# Altium schematic sheet ADC.SchDoc
size A4; SheetNumber: 7; SheetTotal: 12
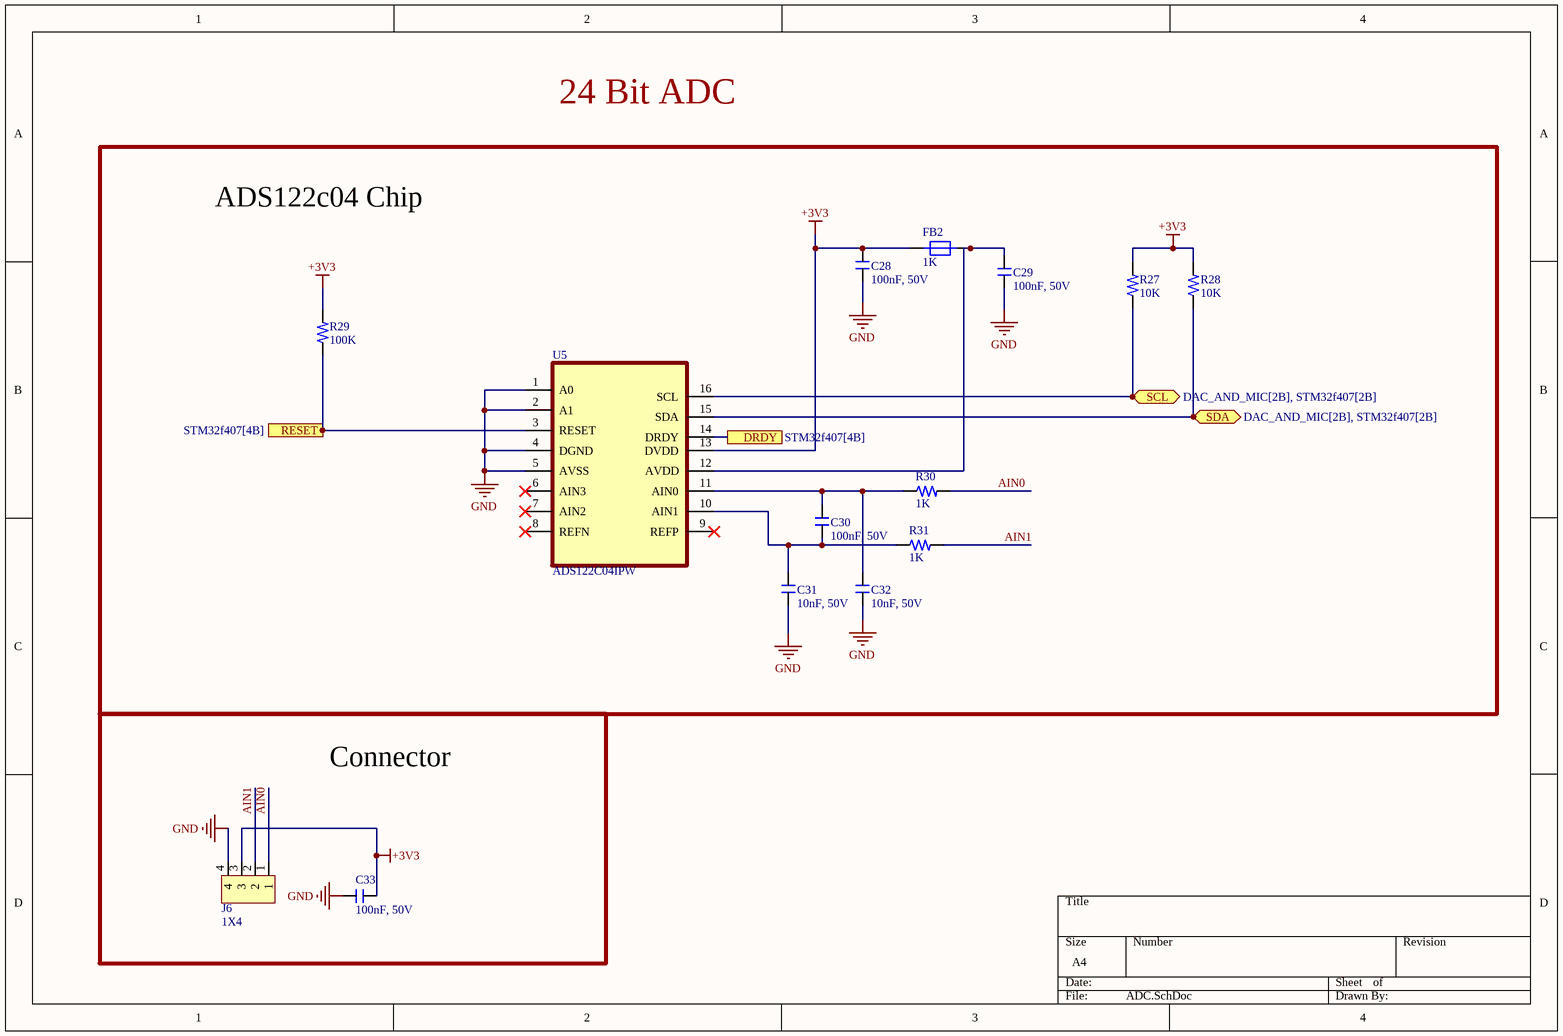
[diagram p0: ADC.SchDoc]

## Parts
C28  100nF, 50V  [Capacitor_0805]
C29  100nF, 50V  [Capacitor_0805]
C30  100nF, 50V  [Capacitor_0805]
C31  10nF, 50V  [Capacitor_0805]
C32  10nF, 50V  [Capacitor_0805]
C33  100nF, 50V  [Capacitor_0805]
FB2  1K  [FB_0805]
J6  1X4  [Header_1X4_2.54mm]
R27  10K  [Resistor_0603]
R28  10K  [Resistor_0603]
R29  100K  [Resistor_0603]
R30  1K  [Resistor_0603]
R31  1K  [Resistor_0603]
U5  ADS122C04IPW  [16_TSSOP]

## Blocks framed on the sheet
ADS122c04 Chip: C28-C32 FB2 R27-R31 U5
Connector: C33 J6

## Ports
DRDY (see STM32f407[4B]), RESET (see STM32f407[4B]), SCL (bidir, see DAC_AND_MIC[2B], STM32f407[2B]), SDA (bidir, see DAC_AND_MIC[2B], STM32f407[2B])

## Nets
+3V3: C28.2 C33.2 FB2.1 J6.3 R27.2 R28.2 R29.2 U5.13(DVDD)
GND: C28.1 C29.1 C31.1 C32.1 C33.1 J6.4 U5.1(A0) U5.2(A1) U5.4(DGND) U5.5(AVSS)
AIN0: J6.1 R30.2
AIN1: J6.2 R31.2
DRDY: U5.14(DRDY) ; port DRDY
RESET: R29.1 U5.3(RESET) ; port RESET
SCL: R27.1 U5.16(SCL) ; port SCL
SDA: R28.1 U5.15(SDA) ; port SDA
NetC29_2: C29.2 FB2.2 U5.12(AVDD)
NetC30_1: C30.1 C31.2 R31.1 U5.10(AIN1)
NetC30_2: C30.2 C32.2 R30.1 U5.11(AIN0)

Not connected (* = marked no-connect by the designer): U5 6(AIN3)* 7(AIN2)* 8(REFN)* 9(REFP)*

## Notes on the sheet
- 24 Bit ADC

## Library data of the parts
C28-C30 C33 = Cap_100nF_0805: Multilayer Ceramic Capacitor, 0.1 uF, 50 V, ï¿½ 10%, X7R, 0805 [2012 Metric]; Manufacturer: Samsung; Manufacturer Part Number: CL21B104KBCNNNC; Supplier: Digikey; Supplier Part Number: 1276-1003-1-ND; RoHS: Yes; Category: Ceramic Capacitors; Stock: 674609; Pricing: 1=0,08, 10=0,012, 100=0,0104, 1000=0,008 (USD); Mounting Technology: Surface Mount; Case/Package: 0805; Case Code (Metric): 2012; Case Code (Imperial): 0805; Material: Ceramic; Min Operating Temperature: -55°C; Max Operating Temperature: 125°C; Tolerance: 10%; Value: 100nF; Dielectric: X7R; Packaging: Tape and Reel; Voltage Rating: 50V; Voltage: 50V; Series: CL; Construction: Flat; Voltage Rating (DC): 50V; Length: 2mm; Width: 0.049inch; Height: 0.85mm; Depth: 1.25mm; Thickness: 0.037inch; Radiation Hardening: No; RoHS Compliant: Yes; Lead Free: 5697LeadFree; ComponentLink1URL: https://datasheet.ciiva.com/25710/cl21b104kbcnnnc-25710182.pdf?src-supplier=Digikey; ComponentLink1Description: https://datasheet.ciiva.com/25710/cl21b104kbcnnnc-25710182.pdf?src-supplier=Digikey; ComponentLink2URL: https://datasheet.ciiva.com/29199/454152-da-01-en-vs-kondensator-0805-29199814.pdf?src-supplier=Conrad; ComponentLink2Description: https://datasheet.ciiva.com/29199/454152-da-01-en-vs-kondensator-0805-29199814.pdf?src-supplier=Conrad
C31 C32 = Cap_10nF_0805: Multilayer Ceramic Capacitors MLCC - SMD/SMT 50V 0.01uF X7R 0805 10% AEC-Q200; Manufacturer: KEMET; Manufacturer Part Number: C0805C103K5RECAUTO; Dielectric: 1511DielectricType; Supplier: Arrow Electronics; Supplier Part Number: C0805C103K5RECAUTO; RoHS: Yes; Category: Ceramic Capacitors; Stock: 16; Pricing: 1=0,22, 10=0,0376 (USD); Voltage Rating (DC): 50V; ComponentLink1URL: http://www.farnell.com/datasheets/2723804.pdf?src-supplier=Farnell; ComponentLink1Description: http://www.farnell.com/datasheets/2723804.pdf?src-supplier=Farnell; ComponentLink2URL: https://api.kemet.com/component-edge/download/datasheet/C0805C103K5RECAUTO.pdf?src-supplier=Digikey; ComponentLink2Description: https://api.kemet.com/component-edge/download/datasheet/C0805C103K5RECAUTO.pdf?src-supplier=Digikey; ComponentLink3URL: http://www.farnell.com/datasheets/2723804.pdf?src-supplier=Newark; ComponentLink3Description: http://www.farnell.com/datasheets/2723804.pdf?src-supplier=Newark
FB2 = FB_BLM21SP102SH1D: Ferrite Beads Multi-Layer High Current 1KOhm 25% 100MHz 1.6A 0.12Ohm DCR 0805 Automotive T/R; Manufacturer: Murata; Core Material: 228ConductorMaterial; Value: 120mR; Supplier: Mouser; Supplier Part Number: 81-BLM21SP102SH1D; Manufacturer Part Number: BLM21SP102SH1D; RoHS: Yes; Category: Ferrite Beads and Chips; Stock: 4751; Pricing: 1=0,33, 10=0,179, 50=0,179, 100=0,159, 1000=0,105, 10000=0,083 (USD); RMS Current (Irms): 1.6A; ESR: 120mR; Test Frequency: 100MHz; Tolerance: 25%; Height: 1.05mm; ComponentLink1URL: https://datasheet.octopart.com/BLM21SP102SH1D-Murata-datasheet-138707452.pdf?src-supplier=Future+Electronics; ComponentLink1Description: https://datasheet.octopart.com/BLM21SP102SH1D-Murata-datasheet-138707452.pdf?src-supplier=Future+Electronics; ComponentLink2URL: https://www.murata.com/en-us/api/pdfdownloadapi?cate=luNoiseSupprFilteChipFerriBead&amp;partno=BLM21SP102SH1%23&src-supplier=Digikey; ComponentLink2Description: https://www.murata.com/en-us/api/pdfdownloadapi?cate=luNoiseSupprFilteChipFerriBead&amp;partno=BLM21SP102SH1%23&src-supplier=Digikey; ComponentLink3URL: https://datasheet.octopart.com/BLM21SP102SH1D-Murata-datasheet-166171483.pdf?src-supplier=TME; ComponentLink3Description: https://datasheet.octopart.com/BLM21SP102SH1D-Murata-datasheet-166171483.pdf?src-supplier=TME
J6 = Header_Male_1X4_2.54: THT Vertical Pin Header WR-PHD, Pitch 2.54 mm, Single Row, 4 pins; Manufacturer: Wurth Electronics; Manufacturer Part Number: 61300411121; Number of Positions: 4; Gender: 29Gender; Contact Resistance: 20mR; Current Rating: 3A; Operating Supply Voltage: 250V; Pitch: 0.1inch; Supplier: Digikey; Supplier Part Number: 732-5317-ND; RoHS: Yes; Category: Headers and Wire Housings; Stock: 28749; Pricing: 1=0,17, 10=0,147, 25=0,1216, 50=0,1018, 100=0,0918, 1000=0,085 (USD); Mounting Technology: Through Hole; Contact Plating: Gold; Contact Material: Copper; Color: Black; Min Operating Temperature: -40°C; Max Operating Temperature: 105°C; Number of Rows: 1; Packaging: Bulk; Termination: Solder; Number of Contacts: 4; Series: WR-PHD; Contact Type: Male Pin; Voltage Rating: 250V; Orientation: 5495OrientationType; Height: 8.89mm; Contact Mating Length: 0.236inch; RoHS Compliant: Yes; Reach SVHC Compliant: Unknown; Lead Free: 5697LeadFree; ComponentLink1URL: http://www.farnell.com/cad/1737268.pdf?src-supplier=Element14; ComponentLink1Description: http://www.farnell.com/cad/1737268.pdf?src-supplier=Element14; ComponentLink2URL: https://datasheet.octopart.com/61300411121-W%C3%BCrth-Elektronik-datasheet-21154836.pdf?src-supplier=Element14; ComponentLink2Description: https://datasheet.octopart.com/61300411121-W%C3%BCrth-Elektronik-datasheet-21154836.pdf?src-supplier=Element14; ComponentLink3URL: https://katalog.we-online.de/em/datasheet/6130xx11121.pdf?src-supplier=Digikey; ComponentLink3Description: https://katalog.we-online.de/em/datasheet/6130xx11121.pdf?src-supplier=Digikey
R27 R28 = R_10K_0603: SMD Chip Resistor, 10 kOhm, ï¿½ 1%, 100 mW, 0603 [1608 Metric], Thick Film, General Purpose; Manufacturer: Yageo; Manufacturer Part Number: RC0603FR-0710KL; Voltage Rating (DC): 50V; Value: 10kR; Temperature Coefficient: 100ppm/°C; Voltage Rating: 75V; Power Rating: 100mW; Supplier: Digikey; Supplier Part Number: 311-10.0KHRCT-ND; RoHS: Yes; Category: Chip SMD Resistors; Stock: 2808060; Pricing: 1=0,1, 10=0,009, 100=0,0071, 1000=0,00612 (USD); Case/Package: 0603; Pins: 2; Case Code (Imperial): 0603; Case Code (Metric): 1608; Weight: 7.1E-05oz; Min Operating Temperature: -55°C; Max Operating Temperature: 155°C; Tolerance: 1%; Resistor Type: Thick Film; Packaging: Tape and Reel; Termination: SMD/SMT; Features: Moisture Resistant; Series: RC; Max Power Dissipation: 100mW; Number of Terminations: 2; Resistance Tolerance: 1%; Construction: Rectangular; Length: 1.6mm; Width: 0.8mm; Height: 0.45mm; Depth: 0.8mm; Lead Pitch: 0.3mm; Reach SVHC Compliant: No; Lead Free: 5697LeadFree; RoHS Compliant: Yes; Military Standard: Not; ComponentLink1URL: https://datasheet.ciiva.com/7660/38590-7660789.pdf?src-supplier=Element14; ComponentLink1Description: https://datasheet.ciiva.com/7660/38590-7660789.pdf?src-supplier=Element14; ComponentLink2URL: https://datasheet.ciiva.com/7983/443971-7983596.pdf?src-supplier=Element14; ComponentLink2Description: https://datasheet.ciiva.com/7983/443971-7983596.pdf?src-supplier=Element14; ComponentLink3URL: https://datasheet.ciiva.com/22747/443971-22747519.pdf?src-supplier=Element14; ComponentLink3Description: https://datasheet.ciiva.com/22747/443971-22747519.pdf?src-supplier=Element14; ComponentLink4URL: https://datasheet.ciiva.com/46440/1868787-46440891.pdf?src-supplier=Element14; ComponentLink4Description: https://datasheet.ciiva.com/46440/1868787-46440891.pdf?src-supplier=Element14; ComponentLink5URL: https://datasheet.ciiva.com/7746/1738695-7746239.pdf?src-supplier=Element14; ComponentLink5Description: https://datasheet.ciiva.com/7746/1738695-7746239.pdf?src-supplier=Element14; ComponentLink6URL: https://datasheet.ciiva.com/15189/getdatasheetpartid-409289-15189591.pdf?src-supplier=Verical; ComponentLink6Description: https://datasheet.ciiva.com/15189/getdatasheetpartid-409289-15189591.pdf?src-supplier=Verical
R29 = R_100K_0603: Res Thick Film 0603 100K Ohm 1% 0.1W(1/10W) ±100ppm/C Pad SMD Automotive T/R; Manufacturer: Stackpole Electronics; Manufacturer Part Number: RMCF0603FT100K; Value: 100kR; Max Power Dissipation: 100mW; Temperature Coefficient: 100ppm/°C; Voltage Rating: 75V; Supplier: Digikey; Supplier Part Number: RMCF0603FT100KCT-ND; RoHS: Yes; Category: Chip SMD Resistors; Stock: 722640; Pricing: 1=0,1, 10=0,02, 100=0,0091, 1000=0,0048, 2500=0,00386 (USD); Mounting Technology: Surface Mount; Case/Package: 0603; Case Code (Metric): 1608; Case Code (Imperial): 0603; Contact Plating: Tin,Matte; Min Operating Temperature: -55°C; Max Operating Temperature: 155°C; Tolerance: 1%; Packaging: Tape and Reel; Number of Terminations: 2; Features: Automotive AEC-Q200; Series: RMCF; Construction: Rectangular; Length: 1.55mm; Width: 0.031inch; Height: 0.022inch; Depth: 0.8mm; Radiation Hardening: No; Military Standard: Not; RoHS Compliant: Yes; Lead Free: 5697LeadFree; ComponentLink1URL: https://datasheet.ciiva.com/15193/getdatasheetpartid-362597-15193437.pdf?src-supplier=Verical; ComponentLink1Description: https://datasheet.ciiva.com/15193/getdatasheetpartid-362597-15193437.pdf?src-supplier=Verical
R30 R31 = R_1k_0603: Res Thick Film 0603 1K Ohm 1% 0.1W(1/10W) ±100ppm/C Pad SMD T/R; Manufacturer: Walsin Technologies; Manufacturer Part Number: WR06X1001FTL; Power Rating: 100mW; Temperature Coefficient: 100ppm/°C; Voltage Rating (DC): 75V; Value: 1kR; Voltage Rating: 50V; Supplier: Digikey; Supplier Part Number: 1292-WR06X1001FTLCT-ND; RoHS: Yes; Category: Chip SMD Resistors; Stock: 17; Pricing: 1=0,1, 10=0,015, 50=0,0086, 100=0,0068, 500=0,00418, 1000=0,00345 (USD); Mounting Technology: Surface Mount; Case/Package: 0603; Case Code (Imperial): 0603; Case Code (Metric): 1608; Contact Material: 154ConductorMaterial; Min Operating Temperature: -55°C; Max Operating Temperature: 155°C; Packaging: Tape and Reel; Tolerance: 1%; Resistor Type: Thick Film; Resistance Tolerance: 1%; Package Quantity: 5000; Termination: SMD/SMT; Series: WR06X; Construction: Rectangular; Length: 1.6mm; Width: 0.8mm; Height: 0.45mm; Depth: 0.8mm; RoHS Compliant: Yes; Reach SVHC Compliant: Unknown; Lead Free: 5697LeadFree; Military Standard: Not; ComponentLink1URL: https://datasheet.ciiva.com/26946/getdatasheetpartid-137128-26946327.pdf?src-supplier=Verical; ComponentLink1Description: https://datasheet.ciiva.com/26946/getdatasheetpartid-137128-26946327.pdf?src-supplier=Verical
U5 = IC_ADC_ADS122C04IPW: ADC Quad Delta-Sigma 2ksps 24-bit Serial (I2C) 16-Pin TSSOP Tube; Manufacturer: Texas Instruments; Supplier: Mouser; Supplier Part Number: 595-ADS122C04IPW; Manufacturer Part Number: ADS122C04IPW; RoHS: Yes; Category: Analog to Digital Converters (ADCs); Stock: 2028; Pricing: 1=8,29, 10=6,48, 50=5,74, 100=5,73, 1000=5,73, 10000=5,73 (USD); ComponentLink1URL: http://www.ti.com/lit/ds/symlink/ads122c04.pdf?src-supplier=Digikey; ComponentLink1Description: http://www.ti.com/lit/ds/symlink/ads122c04.pdf?src-supplier=Digikey